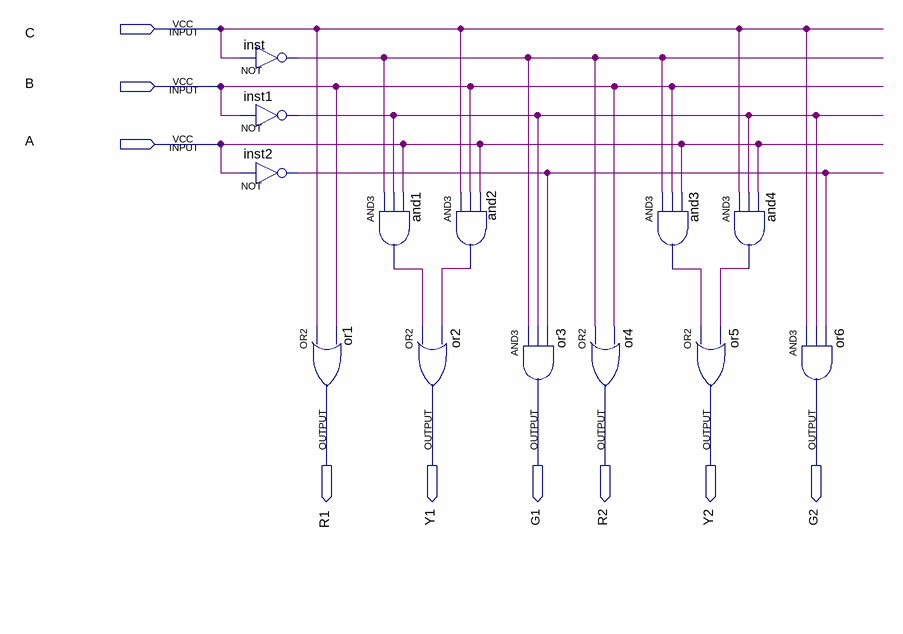
[diagram p0: schematic sheet]
// Quartus schematic Lightdecoder.bdf as structural Verilog: 13 symbols, 9 pins
module Lightdecoder (
  input  C,
  input  B,
  input  A,
  output R1,
  output Y1,
  output G1,
  output R2,
  output Y2,
  output G2
);

  wire and1_out, and2_out, and3_out, and4_out, inst1_out, inst2_out, inst_out;

  not inst (inst_out, C);
  not inst1 (inst1_out, B);
  not inst2 (inst2_out, A);
  or or1 (R1, C, B);
  and and1 (and1_out, inst_out, inst1_out, A);
  and and2 (and2_out, C, B, A);
  or or2 (Y1, and1_out, and2_out);
  and or3 (G1, inst_out, inst1_out, inst2_out);
  or or4 (R2, inst_out, B);
  and and3 (and3_out, inst_out, B, A);
  or or5 (Y2, and3_out, and4_out);
  and and4 (and4_out, C, inst1_out, A);
  and or6 (G2, C, inst1_out, inst2_out);
endmodule
